# Altium schematic sheet ES_PRJ_6C_2L_2026.SchDoc: =SchTitle
size 276 x 198 mm; Organization: ETML-ES; Address1: Av. Recordon 1bis; Address2: CH - 1004 Lausanne; Address3: Tél. 021 316 77 77; Address4: www.etml-es.ch; SheetNumber: 1; SheetTotal: 4; Replace: .; ModA: .; ModB: .; ModC: .; ModD: .
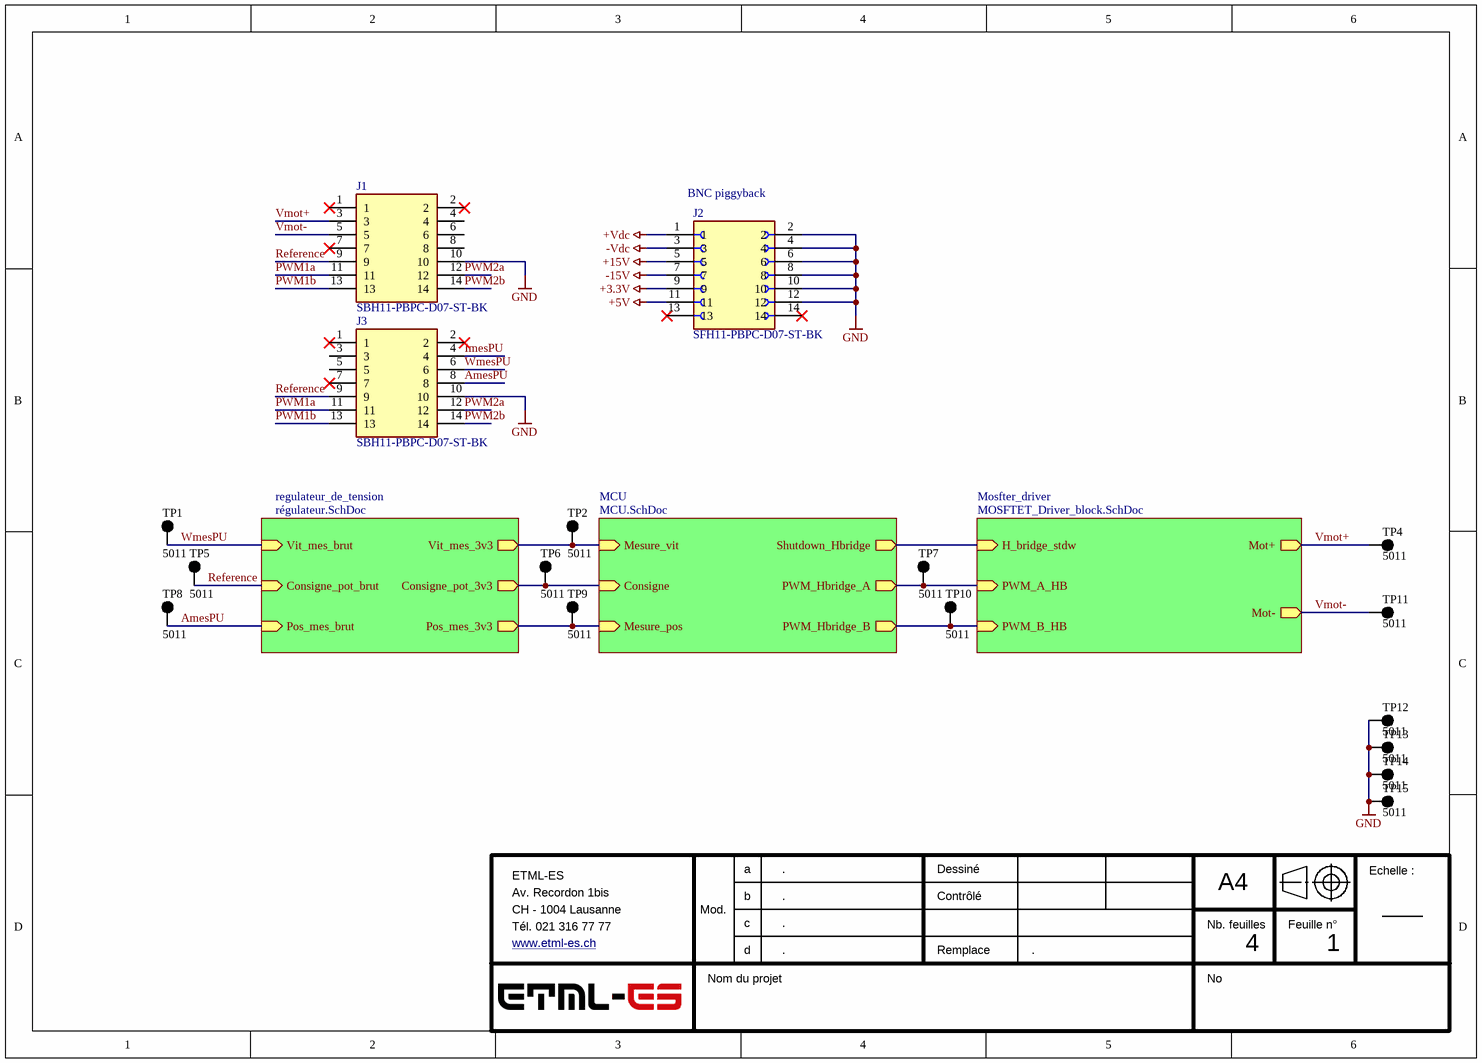
[diagram p0: ES_PRJ_6C_2L_2026.SchDoc]

## Parts
J1  SBH11-PBPC-D07-ST-BK  [SULLINS_SBH11-PBPC-D07-ST-BK]
J2  SFH11-PBPC-D07-ST-BK  [SULLINS_SFH11-PBPC-D07-ST-BK]
J3  SBH11-PBPC-D07-ST-BK  [SULLINS_SBH11-PBPC-D07-ST-BK]
TP1  5011  [KSTN-5011_V]
TP2  5011  [KSTN-5011_V]
TP4  5011  [KSTN-5011_V]
TP5  5011  [KSTN-5011_V]
TP6  5011  [KSTN-5011_V]
TP7  5011  [KSTN-5011_V]
TP8  5011  [KSTN-5011_V]
TP9  5011  [KSTN-5011_V]
TP10  5011  [KSTN-5011_V]
TP11  5011  [KSTN-5011_V]
TP12  5011  [KSTN-5011_V]
TP13  5011  [KSTN-5011_V]
TP14  5011  [KSTN-5011_V]
TP15  5011  [KSTN-5011_V]

## Sub-sheets
MCU = MCU.SchDoc: Mesure_vit (in), Mesure_pos (in), Shutdown_Hbridge (out), PWM_Hbridge_A (out), PWM_Hbridge_B (out), Consigne (in)
Mosfter_driver = MOSFTET_Driver_block.SchDoc: PWM_A_HB (in), PWM_B_HB (in), H_bridge_stdw (in), Mot+ (out), Mot- (out)
regulateur_de_tension = régulateur.SchDoc: Pos_mes_brut (in), Pos_mes_3v3 (out), Vit_mes_3v3 (out), Vit_mes_brut (in), Consigne_pot_brut (in), Consigne_pot_3v3 (out)

## Nets
+3.3V: J2.9
+5V: J2.11
+15V: J2.5
+Vdc: J2.1
-15V: J2.7
-Vdc: J2.3
GND: J1.10 J2.2 J2.4 J2.6 J2.8 J2.10 J2.12 J3.10 TP12.1 TP13.1 TP14.1 TP15.1
AmesPU: J3.8 TP8.1 ; sheet regulateur_de_tension/Pos_mes_brut
ImesPU: J3.4
PWM1a: J1.11 J3.11
PWM1b: J1.13 J3.13
PWM2a: J1.12 J3.12
PWM2b: J1.14 J3.14
Reference: J1.9 J3.9 TP5.1 ; sheet regulateur_de_tension/Consigne_pot_brut
Vmot+: J1.3 TP4.1 ; sheet Mosfter_driver/Mot+
Vmot-: J1.5 TP11.1 ; sheet Mosfter_driver/Mot-
WmesPU: J3.6 TP1.1 ; sheet regulateur_de_tension/Vit_mes_brut
NetTP2_1: TP2.1 ; sheet regulateur_de_tension/Vit_mes_3v3, sheet MCU/Mesure_vit
NetTP6_1: TP6.1 ; sheet regulateur_de_tension/Consigne_pot_3v3, sheet MCU/Consigne
NetTP7_1: TP7.1 ; sheet Mosfter_driver/PWM_A_HB, sheet MCU/PWM_Hbridge_A
NetTP9_1: TP9.1 ; sheet regulateur_de_tension/Pos_mes_3v3, sheet MCU/Mesure_pos
NetTP10_1: TP10.1 ; sheet Mosfter_driver/PWM_B_HB, sheet MCU/PWM_Hbridge_B
(unnamed): sheet Mosfter_driver/H_bridge_stdw, sheet MCU/Shutdown_Hbridge

Not connected (* = marked no-connect by the designer): J1 1* 2* 4 6 7* 8; J2 13* 14*; J3 1* 2* 3 5 7*

## Notes on the sheet
- (near J2) BNC piggyback
- a
- Dessiné
- A4
- Echelle :
- Mod.
- b
- c
- d
- Contrôlé
- Remplace
- Nb. feuilles
- Feuille n°
- Nom du projet
- No

## Library data of the parts
J1 J3 = SBH11-PBPC-D07-ST-BK: Connector Header Through Hole 14 position 0.100 (2.54mm); MF: Sullins Connector; Value: *; Check_prices: https://www.snapeda.com/parts/SBH11-PBPC-D07-ST-BK/Sullins%20Connector%20Solutions/view-part/229418/?ref=eda; Availability: Warning; Price: None; MP: SBH11-PBPC-D07-ST-BK; Package: None; Purchase-URL: https://pricing.snapeda.com/search/part/SBH11-PBPC-D07-ST-BK/?ref=eda; SnapEDA_Link: https://www.snapeda.com/parts/SBH11-PBPC-D07-ST-BK/Sullins%20Connector%20Solutions/view-part/229418/?ref=snap
J2 = SFH11-PBPC-D07-ST-BK: 14 Position Header Connector Through Hole; MF: Sullins Connector; Value: *; Check_prices: https://www.snapeda.com/parts/SFH11-PBPC-D07-ST-BK/Sullins%20Connector%20Solutions/view-part/851415/?ref=eda; Availability: Warning; Package: None; SnapEDA_Link: https://www.snapeda.com/parts/SFH11-PBPC-D07-ST-BK/Sullins%20Connector%20Solutions/view-part/851415/?ref=snap; Purchase-URL: https://pricing.snapeda.com/search/part/SFH11-PBPC-D07-ST-BK/?ref=eda; Price: None; MP: SFH11-PBPC-D07-ST-BK
TP1 TP2 TP4-TP15 = CMP-1672-00003-4: Test Point, Black, Through Hole, RoHS, Bulk; Manufacturer: Keystone; ComponentLink2URL: http://www.keyelco.com/product-pdf.cfm?p=1320; Colour: Black; Pins: 1; REACH SVHC: No SVHC; ComponentLink1URL: http://www.keyelco.com/; PackageReference: 5011; Contact Plating: Silver; Package Quantity: 100; Packaging: Bulk; RoHSCompliant: true; Height: 8.12 mm; PackageDescription: 1-Pin Through Hole Device, Dia 3.17 mm; Mount: Through Hole; Mounting Technology: Through Hole; DatasheetVersion: Rev. F, 12/2013; ComponentLink1Description: Manufacturer URL; Contact Material: Bronze; ComponentLink2Description: Datasheet